# EasyEDA Pro project 主轴照明灯板v1.1.eprj

# Schematic 原理图
Board Name: ESP32s3; Create Date: 2025-05-14; Page Name: 电源; Project Name: 主轴照明灯板v1.1; Schematic Name: 原理图; Update Date: 2026-04-01; Company: 嘉立创EDA; Page Size: A3; Version: V1.0
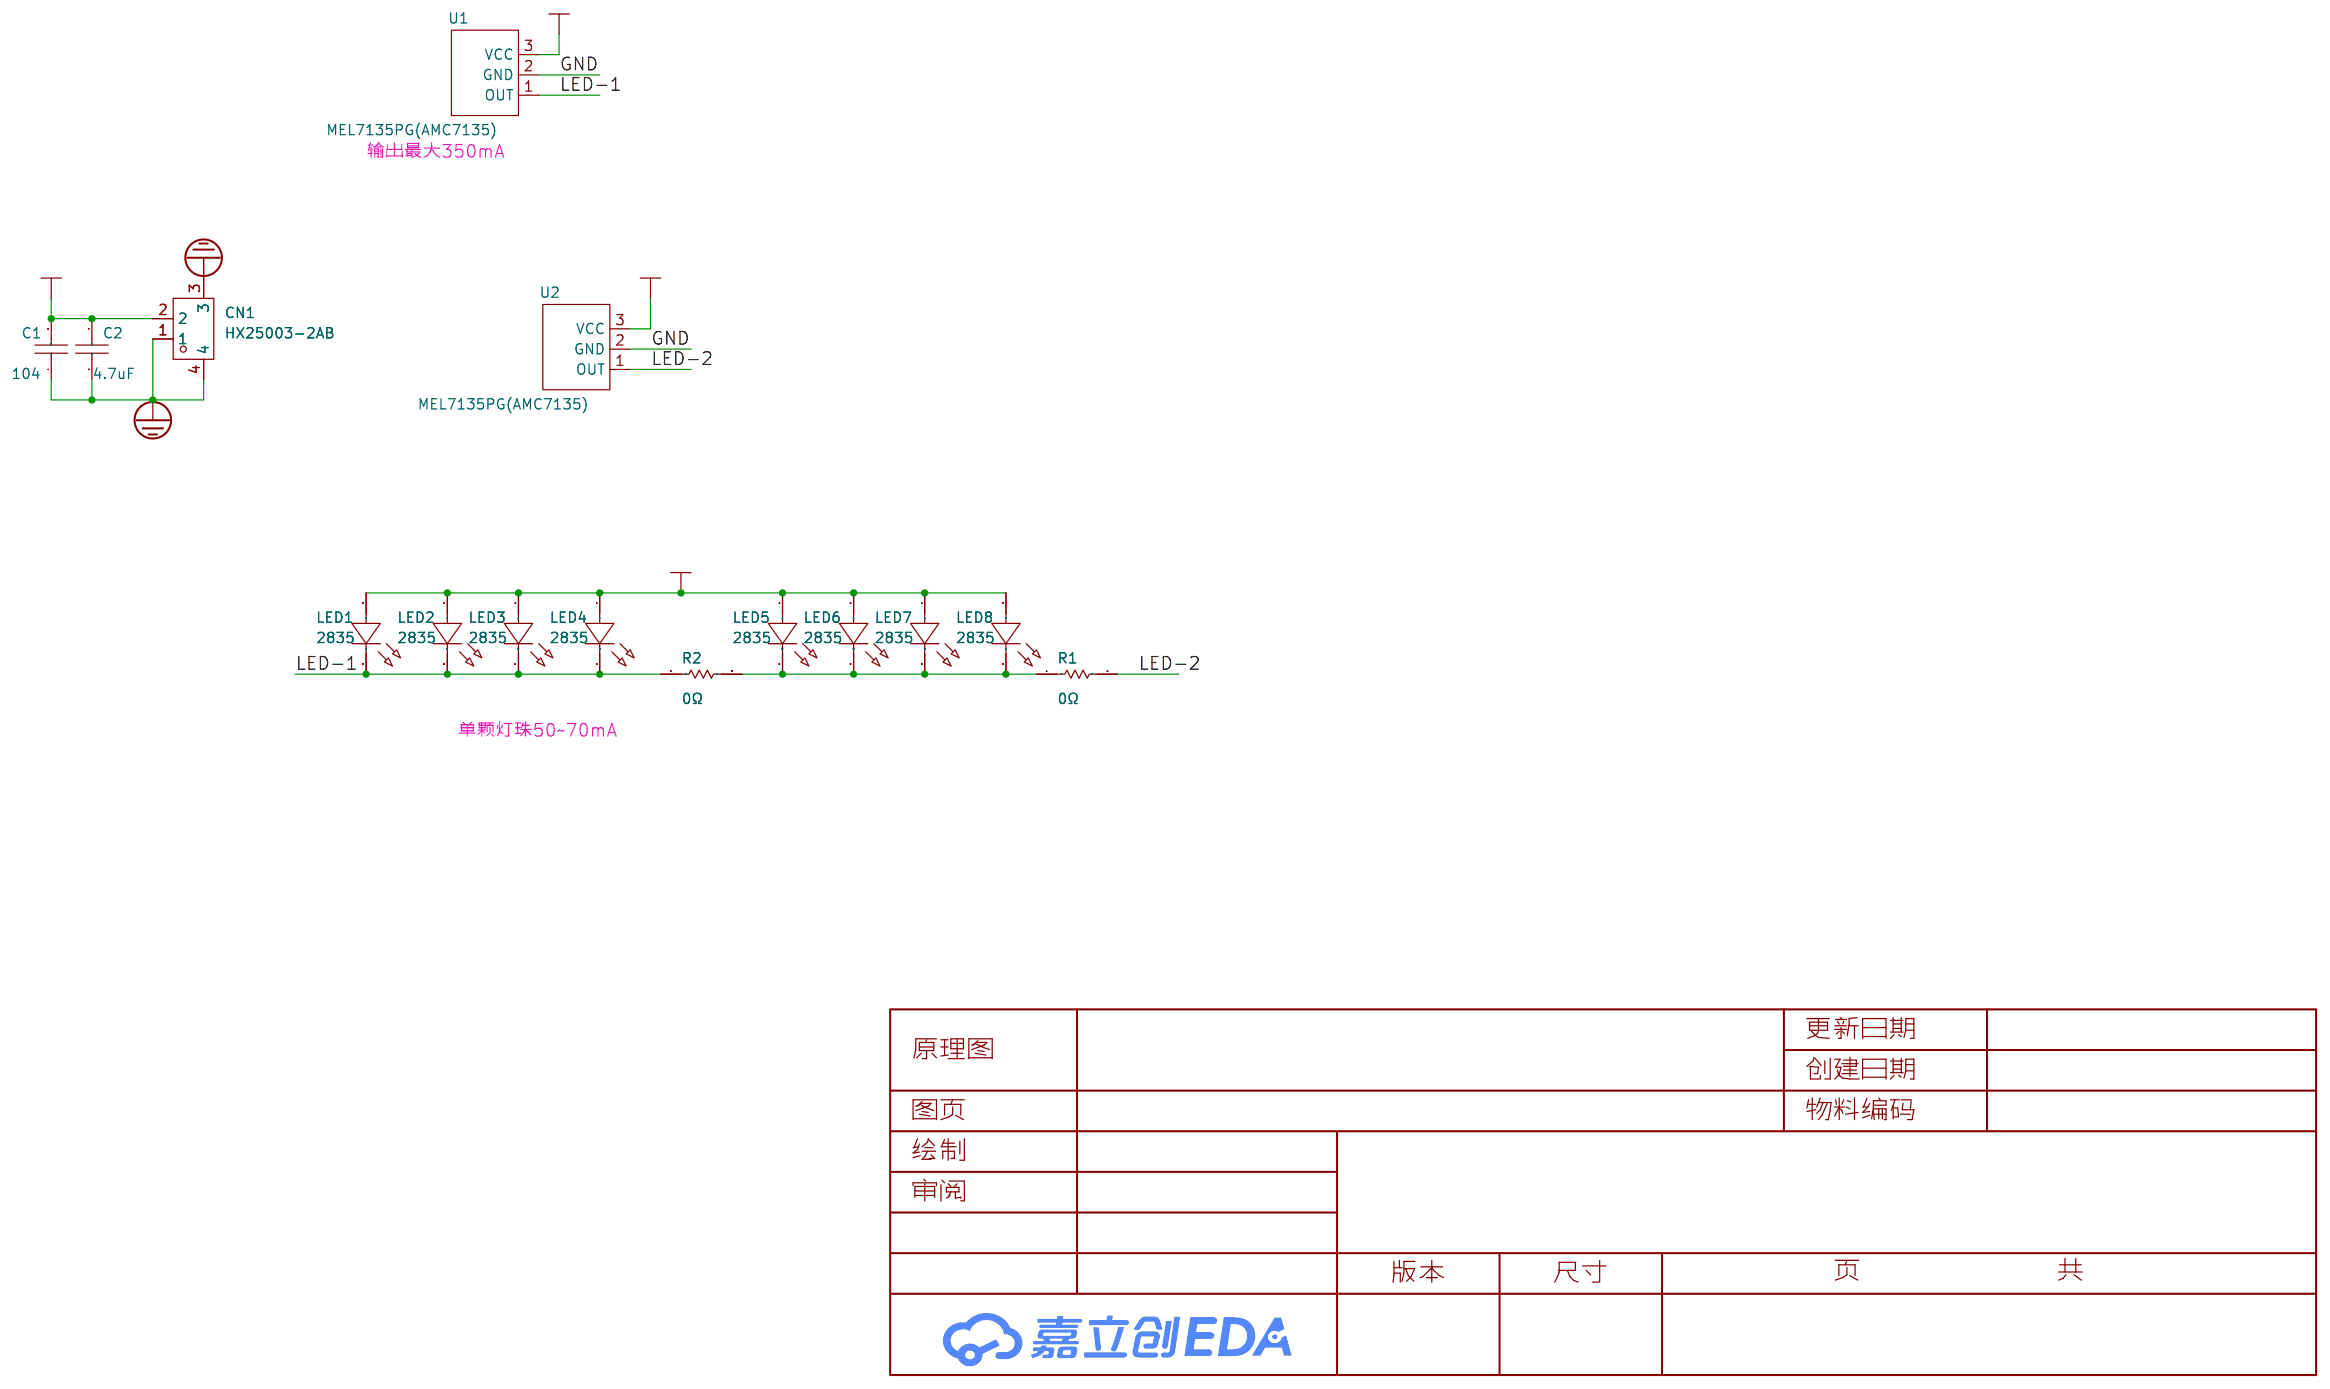
[diagram p0: schematic sheet]

## Parts
C1  104  [0603C]
C2  4.7uF  [0805C]
CN1  HX25003-2AB  [CONN-SMD_P2.50_HX25003-2AB]
LED1  2835  [LED-SMD_L3.5-W2.8_2835]
LED2  2835  [LED-SMD_L3.5-W2.8_2835]
LED3  2835  [LED-SMD_L3.5-W2.8_2835]
LED4  2835  [LED-SMD_L3.5-W2.8_2835]
LED5  2835  [LED-SMD_L3.5-W2.8_2835]
LED6  2835  [LED-SMD_L3.5-W2.8_2835]
LED7  2835  [LED-SMD_L3.5-W2.8_2835]
LED8  2835  [LED-SMD_L3.5-W2.8_2835]
R1  0Ω  [10]
R2  0Ω  [10]
U1  MEL7135PG(AMC7135)  [SOT-89-3_L4.5-W2.5-P1.50-LS4.2-BR]
U2  MEL7135PG(AMC7135)  [SOT-89-3_L4.5-W2.5-P1.50-LS4.2-BR]

## Library data of the parts
C1 = 104: Capacitor (Semiconductor SIM Model); Published: 8-Jun-2000; LatestRevisionDate: 17-Jul-2002; LatestRevisionNote: Re-released for DXP Platform.; PackageReference: C1206; Publisher: Altium Limited; Origin Footprint 2: C1206; Origin Footprint 3: 0402; Origin Footprint 4: 1310[0504]; Origin Footprint 5: 1608[0603]; Origin Footprint 6: C1210; Origin Footprint 7: C0805; Origin Footprint 8: C1206; Origin Footprint 9: 0805; Origin Footprint 10: 0805L; Design Item ID: Cap Semi; Library Name: Miscellaneous Devices
C2 = 105: Design Item ID: CAP; Library Name: SCH--װ--
CN1 = HX25003-2AB: LCSC Part Name: 1x2P 间距:2.5mm 立贴 系列:XH; Supplier Part: C442354; Manufacturer: HX(红星); Supplier Footprint: SMD,P=2.5mm; JLCPCB Part Class: 扩展库; Datasheet: https://item.szlcsc.com/datasheet/HX25003-2AB/442586.html; Supplier: LCSC; Pins Structure: 1x2P; Pitch: 2.5mm; Mounting Type: 立贴; Reference Series: XH; Number of Pins: 2P; Number of Rows: 1; Number of PINs Per Row: 2; Current Rating: 3A; Contact Material: 黄铜; Contact Plating: 锡; Operating Temperature: -25℃~+85℃; Voltage Rating: 250V; Plastic Material: PA66; Flame Retardant Rating: UL94V-0; Color: 白色
LED1-LED8 = 2835: Supplier Part: C9900165166; Supplier Footprint: SMD; Supplier: LCSC
R1 R2 = 10K: Resistor; Published: 8-Jun-2000; LatestRevisionDate: 17-Jul-2002; LatestRevisionNote: Re-released for DXP Platform.; PackageReference: AXIAL-0.3; Publisher: Altium Limited; Origin Footprint 2: AXIAL-0.3; Origin Footprint 3: R0805; Origin Footprint 4: 0805R; Origin Footprint 1: 0603R; Design Item ID: RES; Library Name: SCH封装库
U1 U2 = MEL7135PG: LCSC Part Name: 电流调节器; Supplier Part: C80214; Manufacturer: MICRONE(南京微盟); Supplier Footprint: SOT-89; JLCPCB Part Class: 扩展库; Datasheet: https://item.szlcsc.com/datasheet/MEL7135PG/81359.html; Supplier: LCSC; Voltage - Input(DC): 2.7V~6V; Number of Channels: 1; Output Current: 350mA; Operating temperature: -40℃~+85℃

## Nets
5V_VCC: C1.2 C2.1 CN1.2 LED1.1(A) LED2.1(A) LED3.1(A) LED4.1(A) LED5.1(A) LED6.1(A) LED7.1(A) LED8.1(A) U1.3(VCC) U2.3(VCC)
GND: C1.1 C2.2 CN1.1 CN1.3 CN1.4 U1.2(GND) U2.2(GND)
LED-1: LED1.2(C) LED2.2(C) LED3.2(C) LED4.2(C) R2.1 U1.1(OUT)
LED-2: R1.2 U2.1(OUT)
$9N288495: LED5.2(C) LED6.2(C) LED7.2(C) LED8.2(C) R1.1 R2.2

## Notes on the sheet
- 输出最大350mA
- 单颗灯珠50~70mA

# Board PCB
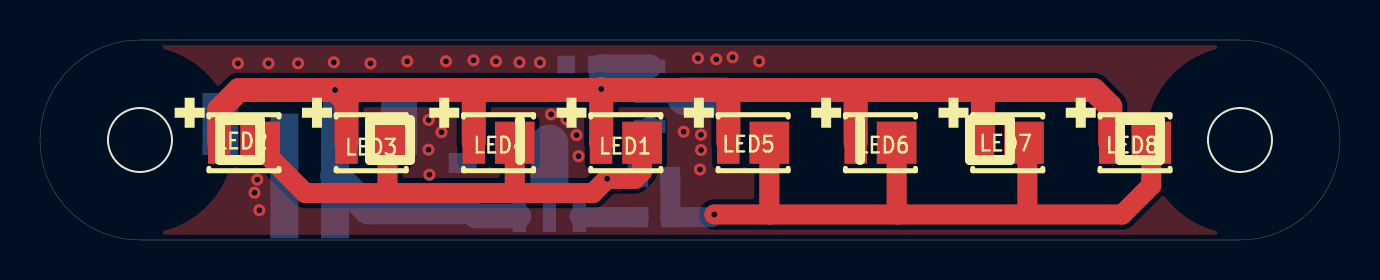
[diagram p1: board, top side]
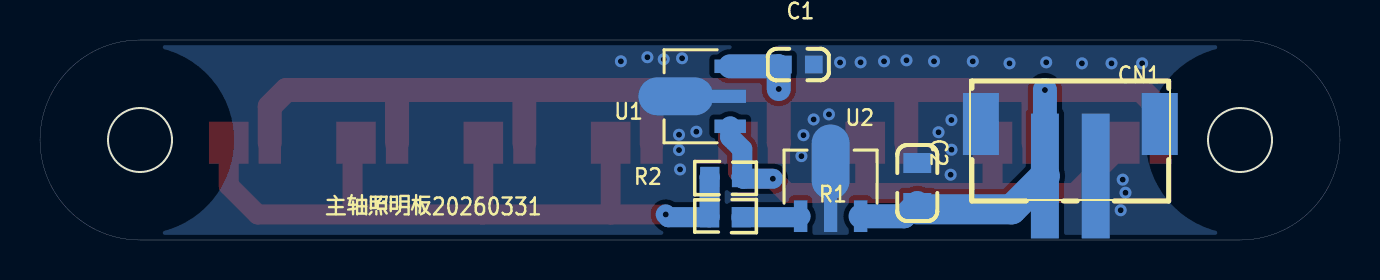
[diagram p2: board, bottom side, seen from below]

Outline 65 x 10 mm; copper layers: Top Layer, Bottom Layer. Coordinates in mm from the lower left corner of the outline.
Outline path: circle c5,5 r1.6 ; circle c60,5 r1.6 ; 5,10 60,10 arc(65,5) 60,0 5,0 arc(0,5) 5,10
Stack: Top Layer 0.035mm / Dielectric1 1.51mm FR4 er 4.5 / Bottom Layer 0.035mm

## Design rules (mm)
template: 用户自定义配置
spacing Default (default): track to track 0.152, other pairs 0 to 0.152
track width Default (default): min 0.254, default 0.254, max 25.4
differential pair differentialPair (default): width min 0.127, default 0.254, max 2.54; gap min 0.152, default 0.152
via Default (default): diameter min 0.25, default 0.61, max 100.025; hole min 0.2, default 0.305, max 59.995

## Placement (name value [footprint] x y rotation side)
C1  104  [0603C]  27.08 8.77 0 bottom
C2  4.7uF  [0805C]  21.14 2.85 90 bottom
CN1  HX25003-2AB  [CONN-SMD_P2.50_HX25003-2AB]  13.49 4.12 0 bottom
LED1  2835  [LED-SMD_L3.5-W2.8_2835]  29.08 4.86 0 top
LED2  2835  [LED-SMD_L3.5-W2.8_2835]  9.98 4.86 0 top
LED3  2835  [LED-SMD_L3.5-W2.8_2835]  16.35 4.86 0 top
LED4  2835  [LED-SMD_L3.5-W2.8_2835]  22.71 4.86 0 top
LED5  2835  [LED-SMD_L3.5-W2.8_2835]  35.44 4.86 0 top
LED6  2835  [LED-SMD_L3.5-W2.8_2835]  41.81 4.86 0 top
LED7  2835  [LED-SMD_L3.5-W2.8_2835]  48.17 4.86 0 top
LED8  2835  [LED-SMD_L3.5-W2.8_2835]  54.54 4.86 0 top
R1  0Ω  [10]  31.62 1.02 180 bottom
R2  0Ω  [10]  29.82 3.27 0 bottom
U1  MEL7135PG(AMC7135)  [SOT-89-3_L4.5-W2.5-P1.50-LS4.2-BR]  31.85 7.18 180 bottom
U2  MEL7135PG(AMC7135)  [SOT-89-3_L4.5-W2.5-P1.50-LS4.2-BR]  25.47 2.54 270 bottom

## Footprints (pads in the part's own frame, mm; a bottom-side part is the same pattern mirrored in y, then rotated)
10
  rect 0.965x1.016 smd: 1(0.101,0.117) 2(1.688,0.117)
0603C
  rect 0.889x0.889 smd: 1(-0.774,0) 2(0.774,0)
0805C
  rect 1x1.4 smd: 1(-1,0) 2(1,0)
CONN-SMD_P2.50_HX25003-2AB
  rect 1.4x6.24 smd: 1(-1.27,0.925) 2(1.27,0.925)
  rect 1.8x3.1 smd: 3(4.47,-1.675) 4(-4.47,-1.675)
LED-SMD_L3.5-W2.8_2835
  rect 1.12x2.1 smd: 1(-1.025,0)
  rect 1.98x2.1 smd: 2(1.025,0)
SOT-89-3_L4.5-W2.5-P1.50-LS4.2-BR
  rect 1.575x0.672 smd: 1(1.356,-1.5) 3(1.356,1.5)
  custom 5.377x1.9 smd: 2(-1.356,0)

## Nets
As in the schematic.

## Via types
v1: diameter 0.6, hole 0.3, Top Layer to Bottom Layer, 34 vias

## Routing (per net, layer and track width the routed paths; a pad name or vN(x,y) marks a point on that pad's centre or on a via; arc(x,y) is an arc through that point)
5V_VCC: length 83.1
  Top Layer w1.2: 34.25,7.5 34.42,7.33 LED5.1 ; 34.25,7.5 40.54,7.5 ; 34.25,7.5 28.06,7.5 ; 28.06,7.5 v1(28.06,7.55) ; 28.06,7.5 28.06,4.87 LED1.1 ; 28.06,7.5 21.76,7.5 ; LED4.1 21.69,7.43 21.76,7.5 ; 40.54,7.5 40.78,7.25 LED6.1 ; 40.54,7.5 47.09,7.5 ; LED7.1 47.15,7.44 47.09,7.5 ; v1(14.76,7.5) 15.32,6.93 LED3.1 ; v1(14.76,7.5) 9.95,7.5 8.96,6.51 LED2.1 ; v1(14.76,7.5) 21.76,7.5 ; 47.09,7.5 52.69,7.5 53.51,6.67 LED8.1
  Bottom Layer w1.2: U1.3 28.07,8.68 28.06,8.67 v1(28.06,7.55) ; U2.3 21.8,1.19 C2.1 ; 14.76,3.2 v1(14.76,7.5)
  Bottom Layer w1.5: 14.76,3.2 16.42,1.53 21.14,1.53
GND:
  vias: v1(9.9,8.83) v1(10.73,2.36) v1(10.86,3.02) v1(10.97,1.49) v1(11.43,8.83) v1(12.9,8.83) v1(14.69,8.88) v1(16.53,8.83) v1(18.36,8.93) v1(19.42,4.52) v1(19.43,6) v1(19.47,3.26) v1(20.07,5.39) v1(20.3,8.93) v1(21.68,8.99) v1(22.8,8.93) v1(23.97,8.88) v1(25,8.88) v1(25.55,6.28) v1(26.32,6.03) v1(26.83,5.24) v1(26.93,4.19) v1(32.18,5.42) v1(32.9,9.09) v1(33,3.53) v1(33.05,5.26) v1(33.05,4.5) v1(33.81,9.04) v1(34.63,9.14) v1(35.96,8.93)
LED-1: length 31.7
  Top Layer w1: LED1.2 30.1,3.43 29.74,3.06 v1(28.36,3.06) 27.64,2.35 23.66,2.35 ; LED2.2 11.01,4.6 13.26,2.35 17.48,2.35 ; 17.48,2.35 23.66,2.35 ; 17.48,2.35 17.37,2.45 LED3.2 ; 23.66,2.35 23.74,2.43 LED4.2
  Bottom Layer w1: v1(28.36,3.06) 29.84,3.06 R2.1 29.89,3.19 29.89,4.54 30.49,5.14 U1.1
LED-2: length 3
  Bottom Layer w1: R1.2 27.02,1.14 U2.1
$9N288495: length 39.4
  Top Layer w1: 49.37,1.53 49.37,4.69 LED7.2 ; 36.45,1.28 42.87,1.28 ; 36.45,1.28 v1(33.71,1.28) ; 36.45,1.28 36.47,1.29 LED5.2 ; 42.87,1.28 42.83,1.32 LED6.2 ; 42.87,1.28 54.11,1.28 55.56,2.73 LED8.2
  Bottom Layer w1: v1(33.71,1.28) 33.57,1.14 R1.1 31.52,3.14 R2.2

## Copper pours and planes (outline as drawn; the poured copper is in the pictures)
GND on Top Layer: -2.5,12.04 65.74,12.04 65.74,-2.14 -2.5,-2.14
GND on Bottom Layer: -2.5,12.04 65.74,12.04 65.74,-2.14 -2.5,-2.14

## Text on the board
Bottom Silkscreen Layer: 主轴照明板20260331
